# EAGLE design board (EAGLE 7.5.0)
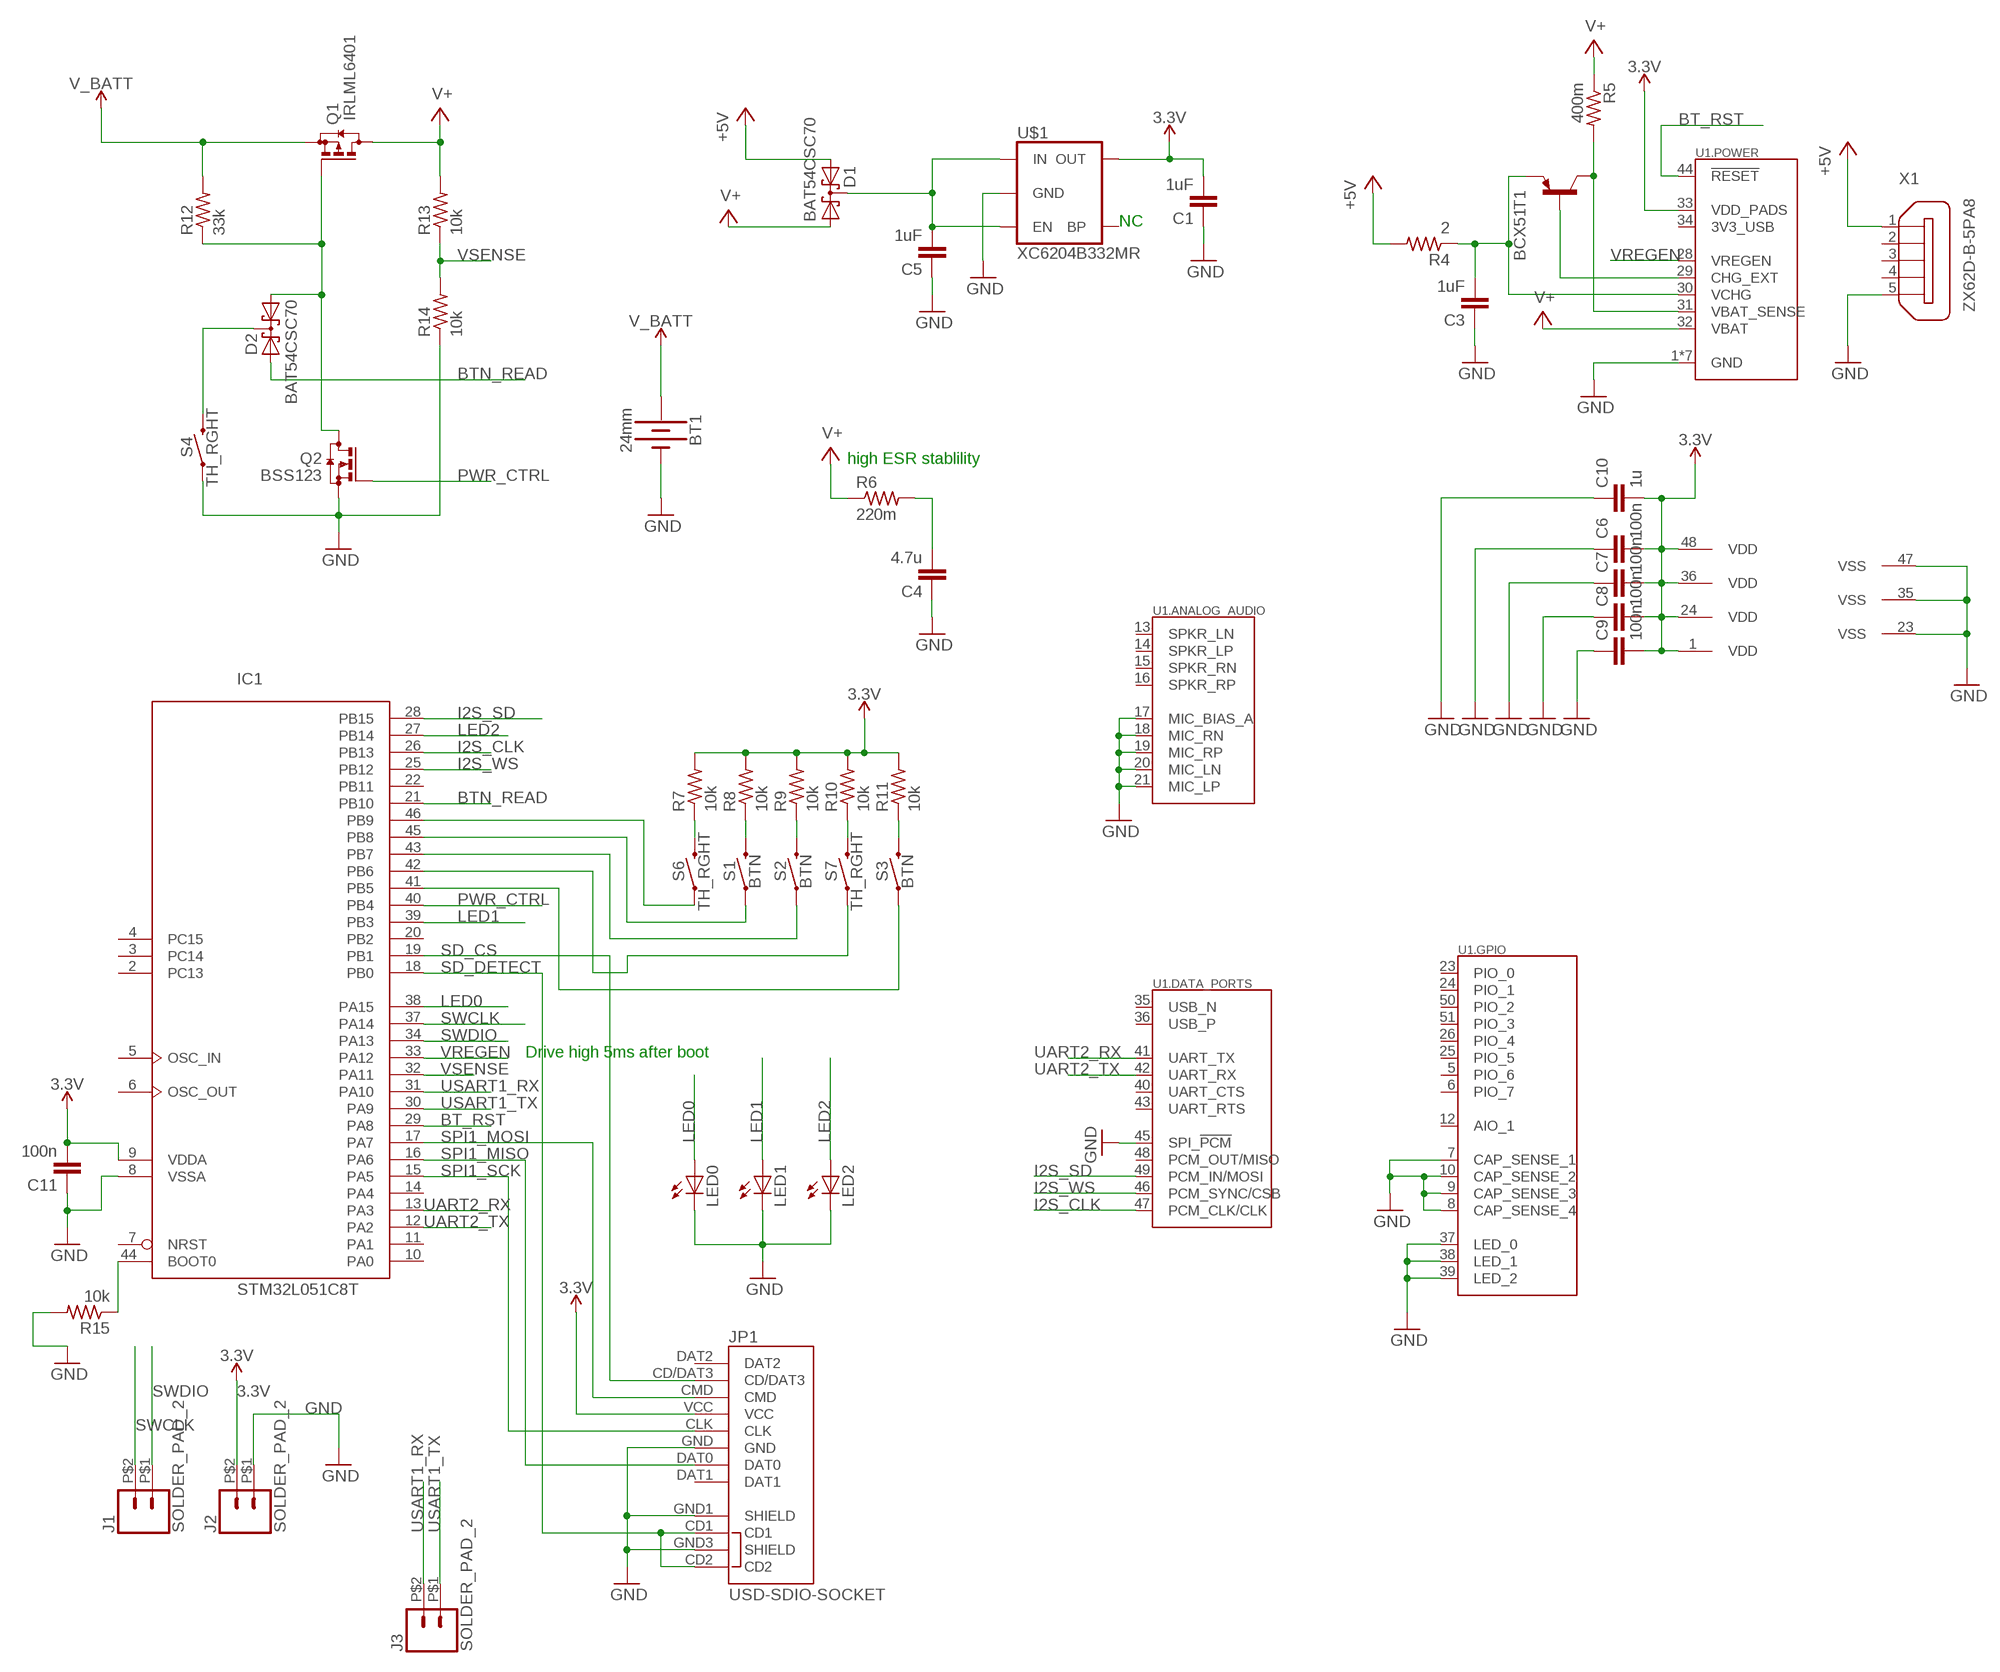
[diagram p0: schematic, sheet 1]

## Parts
BT1  24mm  BATTERY-24.5MM_PTH  [BATTCON_24.5MM_PTH]
C1  1uF  C-EUC1206  [C1206]
C3  1uF  C-EUC1206  [C1206]
C4  4.7u  C-EUC1206  [C1206]
C5  1uF  C-EUC1206  [C1206]
C6  100n  C-EUC0805  [C0805]
C7  100n  C-EUC0805  [C0805]
C8  100n  C-EUC0805  [C0805]
C9  100n  C-EUC0805  [C0805]
C10  1u  C-EUC0805  [C0805]
C11  100n  C-EUC0805  [C0805]
D1  BAT54CSC70  [SOT323-R]
D2  BAT54CSC70  [SOT323-R]
IC1  STM32L051C8T  [LQFP48]
J1  SOLDER_PAD_2  [SOLDER_PAD_2]
J2  SOLDER_PAD_2  [SOLDER_PAD_2]
J3  SOLDER_PAD_2  [SOLDER_PAD_2]
JP1  USD-SDIO-SOCKET  [MICRO-SD-SOCKET-SDIO]
LED0  LEDSML0805  [SML0805]
LED1  LEDSML0805  [SML0805]
LED2  LEDSML0805  [SML0805]
Q1  IRLML6401  BSS84  [SOT23]
Q2  BSS123  [SOT23]
R4  2  R-US_M1206  [M1206]
R5  400m  R-US_M1206  [M1206]
R6  220m  R-US_M1206  [M1206]
R7  10k  R-US_R0805  [R0805]
R8  10k  R-US_R0805  [R0805]
R9  10k  R-US_R0805  [R0805]
R10  10k  R-US_R0805  [R0805]
R11  10k  R-US_R0805  [R0805]
R12  33k  R-US_R0805  [R0805]
R13  10k  R-US_R0805  [R0805]
R14  10k  R-US_R0805  [R0805]
R15  10k  R-US_R0805  [R0805]
S1  BTN  MOMENTARY-SWITCH-SPST-SMD-6.2MM-TALL  [TACTILE_SWITCH_SMD_6.2MM_TALL]
S2  BTN  MOMENTARY-SWITCH-SPST-SMD-6.2MM-TALL  [TACTILE_SWITCH_SMD_6.2MM_TALL]
S3  BTN  MOMENTARY-SWITCH-SPST-SMD-6.2MM-TALL  [TACTILE_SWITCH_SMD_6.2MM_TALL]
S4  TH_RGHT  MOMENTARY-SWITCH-SPST-PTH-RIGHT-ANGLE  [TACTILE_SWITCH_PTH_RIGHT_ANGLE]
S6  TH_RGHT  MOMENTARY-SWITCH-SPST-PTH-RIGHT-ANGLE  [TACTILE_SWITCH_PTH_RIGHT_ANGLE]
S7  TH_RGHT  MOMENTARY-SWITCH-SPST-PTH-RIGHT-ANGLE  [TACTILE_SWITCH_PTH_RIGHT_ANGLE]
T1  BCX51  -PNP-SOT89-ECB  [SOT89-ECB]
U1  BC127"  [BC127]
U$1  XC6204B332MR  V_REG_SPX3819-SOT23-5  [SOT23-5]
X1  ZX62D-B-5PA8  [ZX62D-B-5PA8]

## Nets
3.3V: C1.2 C6.2 C7.2 C8.2 C9.2 C10.2 C11.2 IC1.1(VDD) IC1.9(VDDA) IC1.24(VDD) IC1.36(VDD) IC1.48(VDD) J2.P$2 JP1.VCC R7.2 R8.2 R9.2 R10.2 R11.2 U1.33(.POWER:VDD_PADS) U$1.5(OUT)
+5V [Power]: D1.2(A2) R4.2 X1.1
BOOT0: IC1.44(BOOT0) R15.1
BT_RST: IC1.29(PA8) U1.44(.POWER:!RESET)
BTN_READ: D2.2(A2) IC1.21(PB10)
GND: BT1.2(-) C1.1 C3.1 C4.1 C5.1 C6.1 C7.1 C8.1 C9.1 C10.1 C11.1 IC1.8(VSSA) IC1.23(VSS) IC1.35(VSS) IC1.47(VSS) J2.P$1 JP1.GND JP1.GND1(SHIELD) JP1.GND3(SHIELD) LED0.C LED1.C LED2.C Q2.2(S) R14.1 R15.2 S4.1 U1.1(.POWER:GND) U1.2(.POWER:GND) U1.3(.POWER:GND) U1.4(.POWER:GND) U1.7(.GPIO:CAP_SENSE_1) U1.8(.GPIO:CAP_SENSE_4) U1.9(.GPIO:CAP_SENSE_3) U1.10(.GPIO:CAP_SENSE_2) U1.11(.POWER:GND) U1.17(.ANALOG_AUDIO:MIC_BIAS_A) U1.18(.ANALOG_AUDIO:MIC_RN) U1.19(.ANALOG_AUDIO:MIC_RP) U1.20(.ANALOG_AUDIO:MIC_LN) U1.21(.ANALOG_AUDIO:MIC_LP) U1.22(.POWER:GND) U1.27(.POWER:GND) U1.37(.GPIO:LED_0) U1.38(.GPIO:LED_1) U1.39(.GPIO:LED_2) U1.45(.DATA_PORTS:SPI_!PCM) U$1.2(GND) X1.5
I2S_CLK: IC1.26(PB13) U1.47(.DATA_PORTS:PCM_CLK/CLK)
I2S_SD: IC1.28(PB15) U1.49(.DATA_PORTS:PCM_IN/MOSI)
I2S_WS: IC1.25(PB12) U1.46(.DATA_PORTS:PCM_SYNC/CSB)
LED0: IC1.38(PA15) LED0.A
LED1: IC1.39(PB3) LED1.A
LED2: IC1.27(PB14) LED2.A
N$4: D2.1(A1) Q1.1(G) Q2.3(D) R12.1
N$5 [Power]: C3.2 R4.1 T1.E U1.30(.POWER:VCHG)
N$6 [Power]: T1.B U1.29(.POWER:CHG_EXT)
N$7 [Power]: R5.2 T1.C U1.31(.POWER:VBAT_SENSE)
N$8: C4.2 R6.2
N$9 [Power]: C5.2 D1.3(CC) U$1.1(IN) U$1.3(EN)
N$12: R7.1 S6.2
N$13: R8.1 S1.B2
N$14: R9.1 S2.B2
N$15: R10.1 S7.2
N$16: R11.1 S3.B2
N$17: IC1.46(PB9) S6.1
N$18: IC1.45(PB8) S1.A2
N$19: IC1.43(PB7) S2.A2
N$20: IC1.42(PB6) S7.1
N$21: IC1.41(PB5) S3.A2
N$25: D2.3(CC) S4.2
PWR_CTRL: IC1.40(PB4) Q2.1(G)
SD_CS: IC1.19(PB1) JP1.CD/DAT3
SD_DETECT: IC1.18(PB0) JP1.CD1 JP1.CD2
SPI1_MISO: IC1.16(PA6) JP1.DAT0
SPI1_MOSI: IC1.17(PA7) JP1.CMD
SPI1_SCK: IC1.15(PA5) JP1.CLK
SWCLK: IC1.37(PA14) J1.P$2
SWDIO: IC1.34(PA13) J1.P$1
UART2_RX: IC1.13(PA3) U1.41(.DATA_PORTS:UART_TX)
UART2_TX: IC1.12(PA2) U1.42(.DATA_PORTS:UART_RX)
USART1_RX: IC1.31(PA10) J3.P$2
USART1_TX: IC1.30(PA9) J3.P$1
V+ [Power]: D1.1(A1) Q1.3(D) R5.1 R6.1 R13.2 U1.32(.POWER:VBAT)
V_BATT [Power]: BT1.3(+) Q1.2(S) R12.2
VREGEN: IC1.33(PA12) U1.28(.POWER:VREGEN)
VSENSE: IC1.32(PA11) R13.1 R14.2
Unconnected: IC1.2(PC13) IC1.3(PC14) IC1.4(PC15) IC1.5(OSC_IN) IC1.6(OSC_OUT) IC1.7(NRST) IC1.10(PA0) IC1.11(PA1) IC1.14(PA4) IC1.20(PB2) IC1.22(PB11) JP1.DAT1 JP1.DAT2 U1.5(.GPIO:PIO_6) U1.6(.GPIO:PIO_7) U1.12(.GPIO:AIO_1) U1.13(.ANALOG_AUDIO:SPKR_LN) U1.14(.ANALOG_AUDIO:SPKR_LP) U1.15(.ANALOG_AUDIO:SPKR_RN) U1.16(.ANALOG_AUDIO:SPKR_RP) U1.23(.GPIO:PIO_0) U1.24(.GPIO:PIO_1) U1.25(.GPIO:PIO_5) U1.26(.GPIO:PIO_4) U1.34(.POWER:3V3_USB) U1.35(.DATA_PORTS:USB_N) U1.36(.DATA_PORTS:USB_P) U1.40(.DATA_PORTS:UART_CTS) U1.43(.DATA_PORTS:UART_RTS) U1.48(.DATA_PORTS:PCM_OUT/MISO) U1.50(.GPIO:PIO_2) U1.51(.GPIO:PIO_3) U$1.4(BP) X1.2 X1.3 X1.4 X1.S1 X1.S2 X1.S3 X1.S4

## Notes on the sheet
- NC
- high ESR stablility
- Drive high 5ms after boot

## Library data of the parts
BT1 = SparkFun-Batteries:BATTERY: Battery - Single Cell A variety of battery chemistries, sizes, and footprints. Device List: 20MM_PTH - Coin Cell Battery Holder - 20mm (PTH) <https://www.sparkfun.com/products/783> 20MM_PTH_KIT- Coin Cell battery Holder - 20 mm (PTH) <http://www.sparkfun.com/products/783>kit version with special mask 6.8MM_PTH - Coin Cell Battery Holder - 6.8MM(SMD) <https://www.digikey.com/product-detail/en/seiko-instruments/MS621FE-FL11E/728-1057-ND/1889208?WT.srch=1&gclid=CNOQ5a6LzdQCFZS2wAodXCkE0g> 12MM_SMD - Coin Cell Battery Holder - 12mm (SMD) <https://www.sparkfun.com/products/10592> 12MM_PTH - Coin Cell Battery Holder - 12mm (PTH) <https://www.sparkfun.com/products/7948> 20MM_SMD - 20mm Coin Cell Battery Holder (SMD) (2 legs) Used on the Big Time Watch Kit <https://www.sparkfun.com/products/11734> 20MM_SMD_4LEGS - Coin Cell Battery Holder - 20mm (SMD) <https://www.sparkfun.com/products/11892> 20MM_SMD_4LEGS_OVERPASTE - Coin Cell Battery Holder - 20mm (SMD) <https://www.sparkfun.com/products/11892> (Over-paste on the legs) 24.5MM_PTH - Coin Cell Battery Holder - 24.5mm (PTH) <https://www.sparkfun.com/products/8863> 9V - 9V Battery Holder - PC Mount Used on the SparkFun SparkPunk Sound Kit <https://www.sparkfun.com/products/11177> and SparkFun SparkPunk Sequencer Kit <https://www.sparkfun.com/products/12707> 18650 - Battery Holder - 18650 (PTH) <https://www.sparkfun.com/products/13113> AA - Battery Holder - 1xAA (PTH) <https://www.sparkfun.com/products/7949> AAA - Battery Holder - 1xAAA (PTH) <https://www.sparkfun.com/products/12718> AA_KIT - Battery Holder - 1xAA (PTH) <https://www.sparkfun.com/products/7949> Special kit package - pads only have exposed copper on one side of the board. AAA_KIT - Battery Holder - 1xAAA (PTH) <https://www.sparkfun.com/products/12718> Special kit package - pads only have exposed copper on one side of the board.; SF_SKU: PRT-08863
C1 C3-C11 = rcl:C-EU: CAPACITOR, European symbol
D1 D2 = diode:BAT54C: Schottky Diodes Source: Fairchild .. BAT54.pdf
IC1 = micro-stm_v3:STM32L051C*T: ARM 32-bit Cortex™-M0+ CPU 32 MHz maximum frequency 32 to 64 Kbytes of Flash memory 2 kbyte of Data EEPROM 8 kbytes of SRAM 37 GPIOs 1.8 to 3.6 V application supply
J1-J3 = SparkFun-Connectors:SOLDER_PAD_2: Solder Pad for LuMini Rings
JP1 = SparkFun-Retired:USD-SDIO-SOCKET: microSD Socket Push-push type uSD socket with full SDIO signal mapping. Spark Fun Electronics SKU : PRT-00127. tDoc lines correctly indicate media card edge positions when inserting (unlocked, locked, depressed). NOTE: CD1 and CD2 are connected internally, and short to ground when card is removed.; PROD_ID: CONN-07820
LED0 LED1 LED2 = led:LED: LED OSRAM: - CHIPLED LG R971, LG N971, LY N971, LG Q971, LY Q971, LO R971, LY R971 LH N974, LH R974 LS Q976, LO Q976, LY Q976 LO Q996 - Hyper CHIPLED LW Q18S LB Q993, LB Q99A, LB R99A - SideLED LS A670, LO A670, LY A670, LG A670, LP A670 LB A673, LV A673, LT A673, LW A673 LH A674 LY A675 LS A676, LA A676, LO A676, LY A676, LW A676 LS A679, LY A679, LG A679 - Hyper Micro SIDELED® LS Y876, LA Y876, LO Y876, LY Y876 LT Y87S - SmartLED LW L88C, LW L88S LB L89C, LB L89S, LG L890 LS L89K, LO L89K, LY L89K LS L896, LA L896, LO L896, LY L896 - TOPLED LS T670, LO T670, LY T670, LG T670, LP T670 LSG T670, LSP T670, LSY T670, LOP T670, LYG T670 LG T671, LOG T671, LSG T671 LB T673, LV T673, LT T673, LW T673 LH T674 LS T676, LA T676, LO T676, LY T676, LB T676, LH T676, LSB T676, LW T676 LB T67C, LV T67C, LT T67C, LS T67K, LO T67K, LY T67K, LW E67C LS E67B, LA E67B, LO E67B, LY E67B, LB E67C, LV E67C, LT E67C LW T67C LS T679, LY T679, LG T679 LS T770, LO T770, LY T770, LG T770, LP T770 LB T773, LV T773, LT T773, LW T773 LH T774 LS E675, LA E675, LY E675, LS T675 LS T776, LA T776, LO T776, LY T776, LB T776 LHGB T686 LT T68C, LB T68C - Hyper Mini TOPLED® LB M676 - Mini TOPLED Santana® LG M470 LS M47K, LO M47K, LY M47K Source: http://www.osram.convergy.de LUXEON: - LUMILED® LXK2-PW12-R00, LXK2-PW12-S00, LXK2-PW14-U00, LXK2-PW14-V00 LXK2-PM12-R00, LXK2-PM12-S00, LXK2-PM14-U00 LXK2-PE12-Q00, LXK2-PE12-R00, LXK2-PE12-S00, LXK2-PE14-T00, LXK2-PE14-U00 LXK2-PB12-K00, LXK2-PB12-L00, LXK2-PB12-M00, LXK2-PB14-N00, LXK2-PB14-P00, LXK2-PB14-Q00 LXK2-PR12-L00, LXK2-PR12-M00, LXK2-PR14-Q00, LXK2-PR14-R00 LXK2-PD12-Q00, LXK2-PD12-R00, LXK2-PD12-S00 LXK2-PH12-R00, LXK2-PH12-S00 LXK2-PL12-P00, LXK2-PL12-Q00, LXK2-PL12-R00 Source: www.luxeon.com KINGBRIGHT: KA-3528ASYC Source: www.kingbright.com
Q1 = transistor-small-signal:BSS84: P-CHANNEL MOS FET
Q2 = transistor-small-signal:BSS123: N-CHANNEL MOS FET
R4-R6 = diversity-monitor:R-US_: RESISTOR, American symbol
R7-R15 = resistor:R-US_: RESISTOR, American symbol
S1-S3 = SparkFun-Switches:MOMENTARY-SWITCH-SPST: Momentary Switch (Pushbutton) - SPST Normally-open (NO) SPST momentary switches (buttons, pushbuttons). Variants PTH-12MM - 12mm square, through-hole Momentary Pushbutton Switch - 12mm Square <https://www.sparkfun.com/products/9190> (COM-09190) PTH-6.0MM, PTH-6.0MM-KIT - 6.0mm square, through-hole Mini Pushbutton Switch <https://www.sparkfun.com/products/97> (COM-00097) KIT package intended for soldering kit's - only one side of pads' copper is exposed. PTH-RIGHT-ANGLE-KIT - Right-angle, through-hole Right Angle Tactile Button <https://www.sparkfun.com/products/10791> - Used on SparkFun BigTime Watch Kit <https://www.sparkfun.com/products/11734> SMD-12MM - 12mm square, surface-mount Tactile Button - SMD (12mm) <https://www.sparkfun.com/products/12993> (COM-12993) Used on SparkFun PicoBoard <https://www.sparkfun.com/products/11888> SMD-4.5MM - 4.5mm Square Trackball Switch Used on SparkFun Blackberry Trackballer Breakout <https://www.sparkfun.com/products/13169> SMD-4.6MMX2.8MM - 4.60mm x 2.80mm, surface mount Used on SparkFun SAMD21 Mini Breakout <https://www.sparkfun.com/products/13664> SMD-5.2MM, SMD-5.2-REDUNDANT - 5.2mm square, surface-mount Mini Pushbutton Switch - SMD <https://www.sparkfun.com/products/8720> (COM-08720) Used on Arduino Pro Mini <https://www.sparkfun.com/products/11114> REDUNDANT package connects both switch circuits together SMD-6.0X3.5MM - 6.0 x 3.5mm, surface mount Momentary Reset Switch SMD <https://www.sparkfun.com/products/8229> (COM-08229) SMD-6.2MM-TALL - 6.2mm square, surface mount Tactile Button - SMD (6mm) <https://www.sparkfun.com/products/12992> Used on SparkFun Digital Sandbox <https://www.sparkfun.com/products/12651> SMD-RIGHT-ANGLE - Right-angle, surface mount Used on SparkFun Block for Intel® Edison - Arduino <https://www.sparkfun.com/products/13036>; PROD_ID: SWCH-11966; SF_SKU: COM-12992
S4 S6 S7 = SparkFun-Switches:MOMENTARY-SWITCH-SPST: Momentary Switch (Pushbutton) - SPST Normally-open (NO) SPST momentary switches (buttons, pushbuttons). Variants PTH-12MM - 12mm square, through-hole Momentary Pushbutton Switch - 12mm Square <https://www.sparkfun.com/products/9190> (COM-09190) PTH-6.0MM, PTH-6.0MM-KIT - 6.0mm square, through-hole Mini Pushbutton Switch <https://www.sparkfun.com/products/97> (COM-00097) KIT package intended for soldering kit's - only one side of pads' copper is exposed. PTH-RIGHT-ANGLE-KIT - Right-angle, through-hole Right Angle Tactile Button <https://www.sparkfun.com/products/10791> - Used on SparkFun BigTime Watch Kit <https://www.sparkfun.com/products/11734> SMD-12MM - 12mm square, surface-mount Tactile Button - SMD (12mm) <https://www.sparkfun.com/products/12993> (COM-12993) Used on SparkFun PicoBoard <https://www.sparkfun.com/products/11888> SMD-4.5MM - 4.5mm Square Trackball Switch Used on SparkFun Blackberry Trackballer Breakout <https://www.sparkfun.com/products/13169> SMD-4.6MMX2.8MM - 4.60mm x 2.80mm, surface mount Used on SparkFun SAMD21 Mini Breakout <https://www.sparkfun.com/products/13664> SMD-5.2MM, SMD-5.2-REDUNDANT - 5.2mm square, surface-mount Mini Pushbutton Switch - SMD <https://www.sparkfun.com/products/8720> (COM-08720) Used on Arduino Pro Mini <https://www.sparkfun.com/products/11114> REDUNDANT package connects both switch circuits together SMD-6.0X3.5MM - 6.0 x 3.5mm, surface mount Momentary Reset Switch SMD <https://www.sparkfun.com/products/8229> (COM-08229) SMD-6.2MM-TALL - 6.2mm square, surface mount Tactile Button - SMD (6mm) <https://www.sparkfun.com/products/12992> Used on SparkFun Digital Sandbox <https://www.sparkfun.com/products/12651> SMD-RIGHT-ANGLE - Right-angle, surface mount Used on SparkFun Block for Intel® Edison - Arduino <https://www.sparkfun.com/products/13036>; PROD_ID: CONN-10672; SF_SKU: COM-10791
T1 = transistor:*-PNP-: PNP Transistror
U1 = SparkFun-RF:BC127: Blue Creations BC127 BLE module The BC127 is a highly flexible, low power, small form factor Bluetooth Version 4.0 Certified Audio module. It comes preloaded with BlueCreation Melody software, and is ideal for developers who want to quickly and cost effectively integrate Bluetooth functionality into their products. SparkFun Products: Bluetooth SMD Module - BC127 <https://www.sparkfun.com/products/12819> (WRL-12819) Bluetooth Audio Breakout - BC127 <https://www.sparkfun.com/products/11927> (WRL-11927) Purpletooth Jamboree - BC127 Development Board <https://www.sparkfun.com/products/11924> (WRL-11924); PROD_ID: IC-11659
U$1 = SparkFun-IC-Power:V_REG_SPX3819: SPX3819 Voltage Regulator 3.3V 500mA, 16V input Datasheet <https://www.exar.com/content/document.ashx?id=22106> SparkFun Products: SparkFun Serial Controlled Motor Driver <https://www.sparkfun.com/products/13911>; PROD_ID: VREG-13321; VALUE: SPX3819M5_3_3
X1 = zx62d-b-5pa8-oshpark_10:ZX62D-B-5PA8: Micro USB Type B Connector - Standard, Shell Through Hole Source: http://www.hirose.co.jp/cataloge_hp/ed_ZX_20140804.pdf; MF: Hirose; MPN: ZX62D-B-5PA8; OC_FARNELL: 2300438; OC_NEWARK: 69W0712

## Net classes
1 Power: width 0.254 mm

## Board
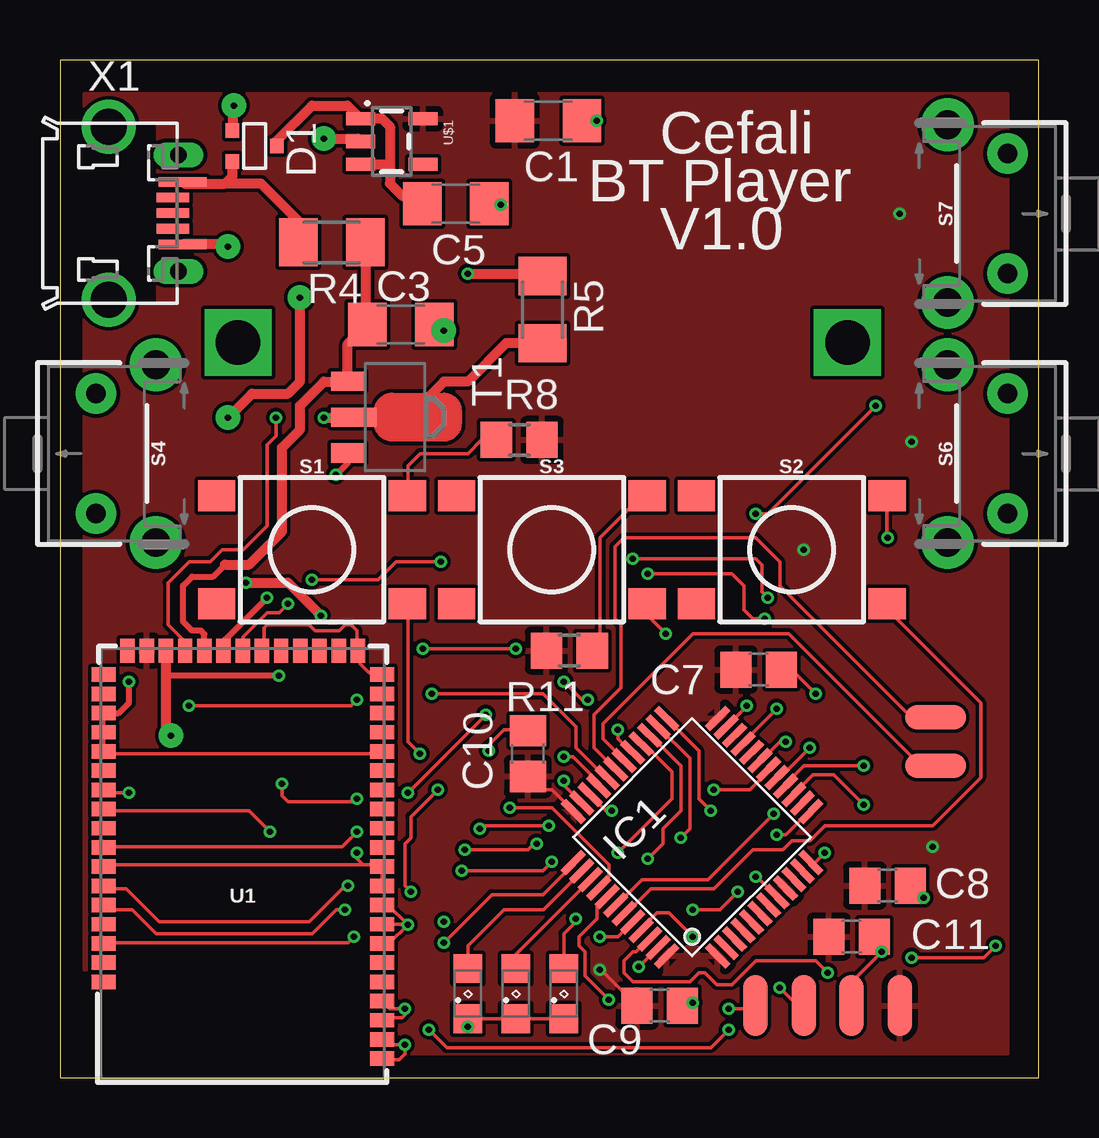
[diagram p1: board, top side]
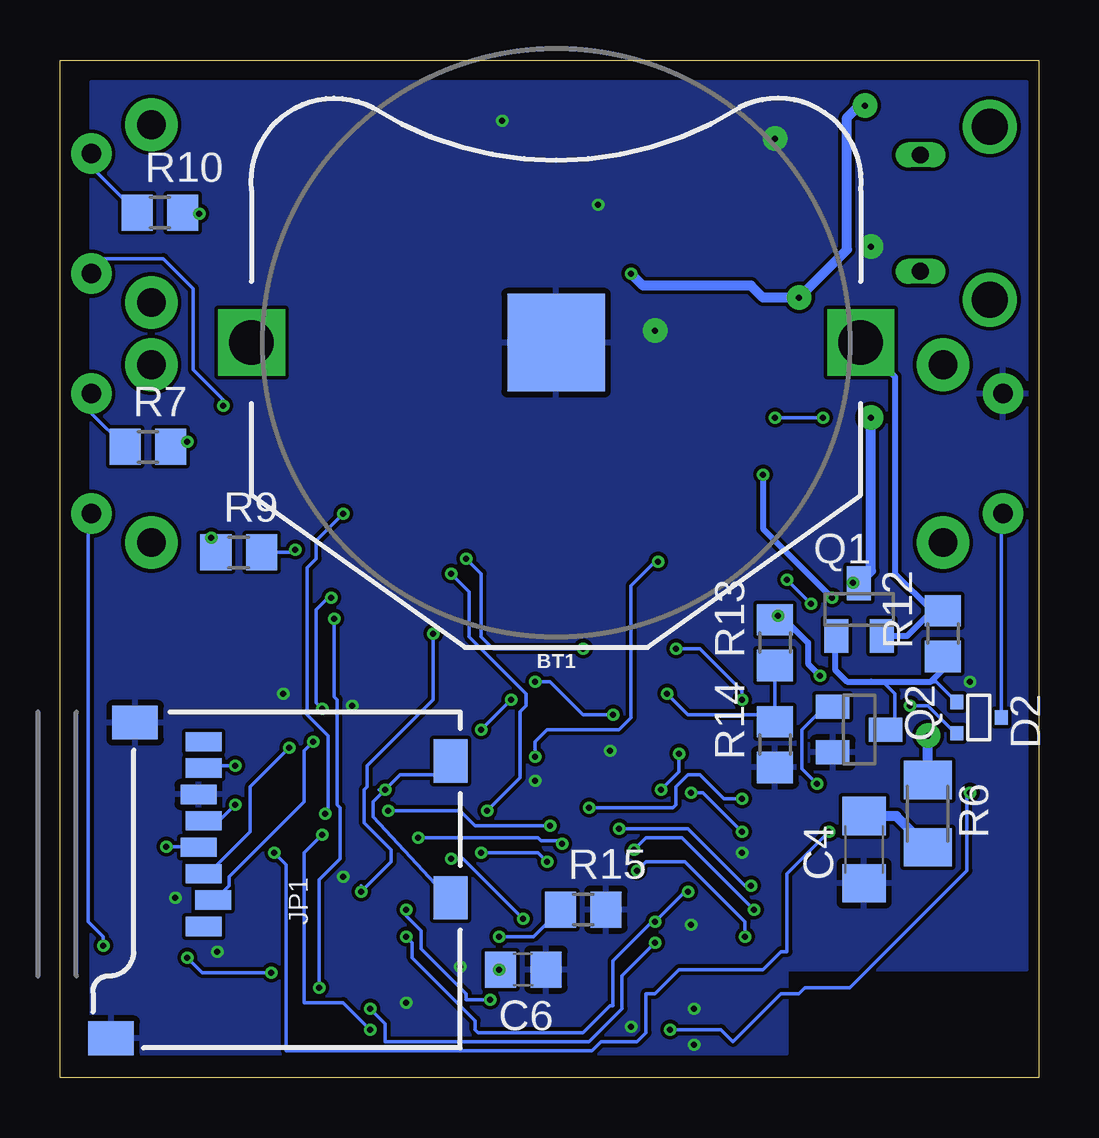
[diagram p2: board, bottom side, seen from below]

Size 40.81 x 42.4 mm. Coordinates in mm from the lower left corner, seen from the top.
Outline: 0,0 40.81,0 40.81,42.4 0,42.4 0,0
Copper layers (1*16): Top 0.035559375mm / dielectric 1.6mm / Bottom 0.035559375mm
Design rules "oshpark-2layer": minimum track width 6mil, minimum drill 10mil, track to track 6mil, track to pad 6mil, pad to pad 6mil, via to via 6mil, smd to smd 6mil, copper to edge 15mil, drill to drill 6mil, minimum pad ring 5mil, minimum via ring 5mil, stop-mask expansion 2.5mil, vias tented up to drill 0mil, thermal gap 10mil

### Footprints (pad centres in the part's own frame; a part is rotated, then mirrored left to right if it is on the bottom)
BATTCON_24.5MM_PTH = drill 1.854 square: 1 -12.7,0; 3 12.7,0 | smd 4.064 x 4.064: 2 0,0
C1206 = smd 1.6 x 1.8: 1 -1.4,0; 2 1.4,0
C0805 = smd 1.3 x 1.5: 1 -0.95,0; 2 0.95,0
SOT323-R = smd 0.6 x 0.55: 1 -0.65,-0.925; 2 0.65,-0.925; 3 0,0.925
LQFP48 = smd 0.3 x 1.2: 1 -2.75,-4.25; 2 -2.25,-4.25; 3 -1.75,-4.25; 4 -1.25,-4.25; 5 -0.75,-4.25; 6 -0.25,-4.25; 7 0.25,-4.25; 8 0.75,-4.25; 9 1.25,-4.25; 10 1.75,-4.25; 11 2.25,-4.25; 12 2.75,-4.25; 25 2.75,4.25; 26 2.25,4.25; 27 1.75,4.25; 28 1.25,4.25; 29 0.75,4.25; 30 0.25,4.25; 31 -0.25,4.25; 32 -0.75,4.25; 33 -1.25,4.25; 34 -1.75,4.25; 35 -2.25,4.25; 36 -2.75,4.25 | smd 1.2 x 0.3: 13 4.25,-2.75; 14 4.25,-2.25; 15 4.25,-1.75; 16 4.25,-1.25; 17 4.25,-0.75; 18 4.25,-0.25; 19 4.25,0.25; 20 4.25,0.75; 21 4.25,1.25; 22 4.25,1.75; 23 4.25,2.25; 24 4.25,2.75; 37 -4.25,2.75; 38 -4.25,2.25; 39 -4.25,1.75; 40 -4.25,1.25; 41 -4.25,0.75; 42 -4.25,0.25; 43 -4.25,-0.25; 44 -4.25,-0.75; 45 -4.25,-1.25; 46 -4.25,-1.75; 47 -4.25,-2.25; 48 -4.25,-2.75
SOLDER_PAD_2 = smd 1.016 x 2.54: P$1 -1.016,0; P$2 1.016,0
MICRO-SD-SOCKET-SDIO = smd 1.8 x 1.4: CD1 11.92,0.4; CD2 6.22,0.4 | smd 0.8 x 1.5: CD/DAT3 6.13,10.3; CLK 9.43,10.7; CMD 7.23,10.7; DAT0 11.63,10.7; DAT1 12.73,10.7; DAT2 5.03,10.7; GND 10.53,10.9; VCC 8.33,10.9 | smd 1.4 x 1.9: GND1 0.37,14.55; GND3 13.52,13.55
SML0805 = smd 1.2 x 1.2: A 1.05,0; C -1.05,0
SOT23 = smd 1 x 1.4: 1 -0.95,-1.1; 2 0.95,-1.1; 3 0,1.1
M1206 = smd 1.6 x 2: 1 -1.4,0; 2 1.4,0
R0805 = smd 1.3 x 1.5: 1 -0.95,0; 2 0.95,0
TACTILE_SWITCH_SMD_6.2MM_TALL = smd 1.55 x 1.3: A1 -3.975,-2.25; A2 3.975,-2.25; B1 -3.975,2.25; B2 3.975,2.25
TACTILE_SWITCH_PTH_RIGHT_ANGLE = drill 0.8 pad 1.7: 1 -2.5,0; 2 2.5,0 | drill 1.2 pad 2.2: ANCHOR1 -3.703,2.5; ANCHOR2 3.703,2.5
SOT89-ECB = smd 0.8 x 1.4: B 1.499,-1.981; E -1.499,-1.981 | smd 0.8 x 1.9: C 0,-1.727
BC127 = smd 1 x 0.6: 1 -5.8,8.1; 2 -5.8,7.3; 3 -5.8,6.5; 4 -5.8,5.7; 5 -5.8,4.9; 6 -5.8,4.1; 7 -5.8,3.3; 8 -5.8,2.5; 9 -5.8,1.7; 10 -5.8,0.9; 11 -5.8,0.1; 12 -5.8,-0.7; 13 -5.8,-1.5; 14 -5.8,-2.3; 15 -5.8,-3.1; 16 -5.8,-3.9; 17 -5.8,-4.7; 18 -5.8,-5.5; 19 -5.8,-6.3; 20 -5.8,-7.1; 21 -5.8,-7.9; 35 5.8,-7.9; 36 5.8,-7.1; 37 5.8,-6.3; 38 5.8,-5.5; 39 5.8,-4.7; 40 5.8,-3.9; 41 5.8,-3.1; 42 5.8,-2.3; 43 5.8,-1.5; 44 5.8,-0.7; 45 5.8,0.1; 46 5.8,0.9; 47 5.8,1.7; 48 5.8,2.5; 49 5.8,3.3; 50 5.8,4.1; 51 5.8,4.9 | smd 0.6 x 1: 22 -4.8,-8.9; 23 -4,-8.9; 24 -3.2,-8.9; 25 -2.4,-8.9; 26 -1.6,-8.9; 27 -0.8,-8.9; 28 0,-8.9; 29 0.8,-8.9; 30 1.6,-8.9; 31 2.4,-8.9; 32 3.2,-8.9; 33 4,-8.9; 34 4.8,-8.9
SOT23-5 = smd 0.55 x 1.2: 1 -0.95,-1.3; 2 0,-1.3; 3 0.95,-1.3; 4 0.95,1.3; 5 -0.95,1.3
ZX62D-B-5PA8 = smd 2 x 0.4: 1 5.225,1.3; 5 5.225,-1.3 | smd 1.35 x 0.4: 2 4.825,0.65; 3 4.825,0; 4 4.825,-0.65 | drill 1.5: S1 2.15,-3.6; S2 2.15,3.6 | drill 0.7 long: S3 5.05,2.425; S4 5.05,-2.425

### Placement (x,y rotation side)
BT1  20.12,30.62 0 bottom
C1  20.36,39.87 180 top
C3  14.21,31.38 180 top
C4  7.29,9.5 90 bottom
C5  16.5,36.41 180 top
C6  21.5,4.5 180 bottom
C7  29.12,17 180 top
C8  34.5,8 180 top
C9  25,3 180 top
C10  19.5,13.5 270 top
C11  33,5.88 180 top
D1  8.12,38.81 270 top
D2  2.5,15 270 bottom
IC1  26.35,10.02 45 top
J1  30,3 180 top
J2  34,3 0 top
J3  36.5,14 90 top
JP1  24.13,1.27 90 bottom
LED0  17,3.5 90 top
LED1  19,3.5 90 top
LED2  21,3.5 90 top
Q1  7.5,19.5 0 bottom
Q2  7.5,14.5 270 bottom
R4  11.33,34.8 180 top
R5  20.11,32 270 top
R6  4.64,11 270 bottom
R7  37.14,26.28 0 bottom
R8  19.14,26.57 0 top
R9  33.36,21.88 0 bottom
R10  36.64,36.04 0 bottom
R11  21.23,17.79 180 top
R12  4,18.5 90 bottom
R13  11,18.12 90 bottom
R14  11,13.88 90 bottom
R15  19,7 0 bottom
S1  10.5,22 0 top
S2  30.5,22 0 top
S3  20.5,22 0 top
S4  1.5,26 270 top
S6  39.5,26 90 top
S7  39.5,36 90 top
T1  13.98,27.52 270 top
U1  7.62,8.89 180 top
U$1  13.83,39.01 270 top
X1  -0.11,36.02 0 top

### Tracks (layer width: path | path; a pad name or v marks a point on that pad's centre or on a via)
3.3V  (via drill 0.25 pad 0.25)
  Top 0.152: v22.5,4.5 22.55,4.5 C9.2 | IC1.36 21.4,11.1 20.5,12 20,12 19.5,12.5 C10.2
  Bottom 0.152: v22.5,4.5 C6.2 | JP1.VCC 35.05,9.62 v36.38,9.62 | R7.2 35.97,26.5 v35.5,26.5 | R10.2 35.65,36 v35,36 | R9.2 31.12,21.88 v31,22
  pour Top: 1,41 39.5,41 39.5,1 10.5,1 10.5,4.5 1,4.5
+5V
  Top 0.406: X1.1 5.18,37.25 6.88,37.25 | 6.88,37.25 7.19,37.56 D1.2 | R4.2 9.93,35.7 8.38,37.25 6.88,37.25
BOOT0  (via drill 0.25 pad 0.25)
  Top 0.152: IC1.44 23.86,6.49 23.25,5.88 v22.5,5.88
  Bottom 0.152: v22.5,5.88 21.07,5.88 R15.1
BT_RST  (via drill 0.25)
  Top 0.152: v12.38,10.25 11.75,9.62 1.88,9.62 U1.44 | v17.75,15.12 v14.5,11.88 | v21,16.5 21.75,15.75 v22,15.75 | v23.25,14.5 23.25,14.12 23.88,13.5 IC1.29
  Bottom 0.152: v12.38,10.25 14,11.88 v14.5,11.88 | v17.75,15.12 19,15.12 20.38,16.5 v21,16.5 | v23.25,14.5 v22,15.75
BTN_READ  (via drill 0.25, 0.25 pad 0.25)
  Top 0.152: v5.38,15.5 12.12,15.5 v12.38,15.75 | v29.88,15.38 28.5,14 IC1.21 | v15.12,17.88 v19,17.88 | v23.88,21.62 29,21.62 29.25,21.38 29.25,20.25 v29.5,20
  Bottom 0.152: v5.38,15.5 4.62,15.5 3.5,14.38 D2.2 | v29.88,15.38 30.12,15.62 30.12,19.5 29.62,20 v29.5,20 | v12.38,15.75 12.38,16.12 14.12,17.88 v15.12,17.88 | v23.88,21.62 23.56,21.31 23.5,21.25 23.25,21 23.25,18.38 22.75,17.88 v19,17.88
GND  (via drill 0.25, 0.25 pad 0.25, 0.25 pad 1.02)
  Top 0.152: U1.37 U1.38 U1.39 1.88,13.5 13.38,13.5 U1.17 13.5,13.62 13.5,14.38 U1.18 13.5,14.5 13.5,15.12 U1.19 13.5,15.25 13.5,15.88 U1.20 13.5,16 13.5,16.75 U1.21 13.38,16.88 12.88,16.88 12.5,17.25 12.5,17.75 U1.22 12.38,17.88 12.38,18.62 12.12,18.88 11.88,18.88 11.62,18.62 10.62,18.62 10.38,18.88 8.62,18.88 8.5,18.75 8.5,17.88 U1.27 | C9.1 26.07,3.12 v26.38,3.12 | IC1.47 24.14,4.62 v24.12,4.62 | IC1.35 21,12.19 v21,12.38 | 19.38,14.57 C10.1 19.45,14.5 18.5,14.5 17.88,13.88 v17.88,13.62 | IC1.23 28.62,15.48 v28.62,15.5 | v34.25,5.25 34.25,5.58 C11.1 v34.25,5.25 | C8.1 35.95,7.5 v36,7.5 | IC1.8 29.06,8.38 v29,8.38 | U1.1 13.46,0.75 14.12,0.75 14.38,1 v14.38,1.38 13.63,1.38 U1.2 | U1.4 13.73,2.88 v14.38,2.88 14.38,2.62 14.25,2.5 13.53,2.5 U1.3 | 13.44,6.38 U1.8 14.48,6.39 v14.5,6.38 | 12.62,8.88 13.34,8.88 U1.11 U1.10 | 12.62,8.88 12.38,9.12 v12.38,9.38 | v7,34.62 6.91,34.72 | v17,2.12 LED0.C LED1.C | 19,2.12 LED1.C | 21,2.12 LED2.C LED1.C | C1.1 v22.37,39.87 v22.38,39.88 | 12.62,8.88 1.88,8.88 U1.45 | v34.25,5.25 33,4 33,3 J2.P$1 | 19.3,2.75 LED1.C | C7.1 30.5,17 v31.5,16 | U1.9 13.69,7.19 v14.5,6.38 | U1.7 13.71,5.59 v14.5,6.38
  Top 0.254: U1.37 2.44,15.19 2.88,15.62 v2.88,16.5
  Top 0.406: 6.91,34.72 X1.5 | U$1.2 12.41,39.12 v11,39.12 | C3.1 15.74,31.38 v16,31.12 | C5.1 18.34,36.41 v18.38,36.38
  pour Bottom: 0.5,41.5 39.5,41.5 39.5,1 10.5,1 10.5,4.5 0.5,4.5
I2S_CLK  (via drill 0.25, 0.25 pad 0.25)
  Top 0.152: U1.47 2.01,7 3,7 4,6 10.5,6 11.5,7 v11.88,7 | v19.88,9.75 19.75,9.75 19.5,9.5 v16.88,9.5 | 25.01,14.62 IC1.26 26.25,13.3 26.25,10.38 v25.88,10
  Bottom 0.152: v19.88,9.75 20,9.88 20.75,9.88 20.88,10 v25.88,10 | v11.88,7 14.88,10 16.38,10 v16.88,9.5
I2S_SD  (via drill 0.25, 0.25 pad 0.25)
  Top 0.152: U1.49 1.85,5.62 12,5.62 v12.25,5.88 | v23.25,9.38 25.5,11.62 25.5,12.75 24.34,13.91 IC1.28 | v16.75,8.62 20.12,8.62 v20.5,9
  Bottom 0.152: v20.5,9 20.88,9.38 v23.25,9.38 | v12.25,5.88 12.25,6.5 14.75,9 16.38,9 v16.75,8.62
I2S_WS  (via drill 0.25 pad 0.25)
  Top 0.152: U1.46 1.94,7.88 2.75,7.88 4.12,6.5 10.38,6.5 11.88,8 v12,8 | IC1.25 25.4,14.85 26.62,13.62 26.62,11.62 v27.12,11.12 | v20.38,10.5 17.62,10.5 v17.5,10.38
  Bottom 0.152: v20.38,10.5 23.5,10.5 24.12,11.12 v27.12,11.12 | v12,8 12.25,8 14.62,10.38 v17.5,10.38
LED0
  Top 0.152: LED0.A 17,5.5 18.5,7 20.15,7 IC1.38
LED1
  Top 0.152: LED1.A 19,5.14 IC1.39
LED2  (via drill 0.25 pad 0.25)
  Top 0.152: IC1.27 24.61,14.26 25.88,13 25.88,11.12 25.12,10.38 25.12,9.75 v24.5,9.12 | v21.5,6.62 21.5,6.5 21,6 LED2.A
  Bottom 0.152: v24.5,9.12 24,9.12 v21.5,6.62
N$4
  Bottom 0.152: D2.1 4.28,16.5 4.5,16.5 | Q2.3 6,14.9 6,16 6.5,16.5 7,16.5
  Bottom 0.254: Q1.1 8.5,18.35 8.5,17 8,16.5 7,16.5 4.5,16.5 4,17 R12.1
N$5
  Top 0.254: U1.30 6.02,18.48 5.88,18.62 5.5,18.62 5.12,19 5.12,20.5 5.5,20.88 6.38,20.88 6.88,21.38
  Top 0.406: 6.88,21.38 7.88,21.38 9.25,22.75 9.25,26.25 10,27 10,28 11,29 11.98,29 T1.E 12,30.57 C3.2 12.93,31.5 13,31.5 12.73,31.77 R4.1
N$6  (via drill 0.25)
  Top 0.254: v8.62,20 6.88,18.25 6.88,17.88 U1.29 | v11.5,25.12 12,25.62 12,26 T1.B
  Bottom 0.254: v8.62,20 11.5,22.88 v11.5,25.12
N$7  (via drill 0.25 pad 0.25)
  Top 0.152: v9,27.5 9,26.75 8.62,26.38 8.62,23 7.62,22 6.75,22 6.25,21.5 5.38,21.5 4.5,20.62 4.5,18.88 5.12,18.25 5.12,17.89 U1.31
  Top 0.406: R5.2 18.6,30.6 17,29 16,29 14.5,27.5 12.27,27.5 T1.C 12.23,27.5 v11,27.5
  Bottom 0.152: v11,27.5 v9,27.5
N$8
  Bottom 0.406: R6.2 5.94,10.9 C4.2
N$9
  Top 0.406: D1.3 9.04,39.04 10.5,40.5 11.98,40.5 U$1.1 13.42,39.95 13.75,39.62 13.75,38 | 13.75,38 13.75,37.25 14.25,36.75 14.76,36.75 C5.2 | U$1.3 13.7,38.05 13.75,38
N$12
  Bottom 0.152: R7.1 39.5,27.69 S6.2
N$13
  Top 0.152: R8.1 17.57,26.57 17,26 15,26 14.5,25.5 14.5,24.27 S1.B2
N$14  (via drill 0.25 pad 0.25)
  Top 0.152: v34.5,22.5 34.48,22.52 S2.B2
  Bottom 0.152: R9.1 34.5,22.07 v34.5,22.5
N$15
  Bottom 0.152: R10.1 39.5,37.95 S7.2
N$16
  Top 0.152: S3.B2 24.25,24.25 22.5,22.5 22.5,18.11 R11.1
N$17  (via drill 0.25, 0.25 pad 0.25)
  Top 0.152: v32,4.38 31.5,4.88 29,4.88 28,3.88 27.38,3.88 26.88,4.38 26.62,4.38 26.25,4 23.88,4 23.5,4.38 23.5,4.88 23.88,5.25 24,5.25 24.5,5.75 IC1.46 | v35.5,5 38.5,5 v39,5.5
  Bottom 0.152: S6.1 39.62,23.38 39.62,6.5 39,5.88 v39,5.5 | v32,4.38 34.88,4.38 v35.5,5
N$18  (via drill 0.25, 0.25 pad 0.25)
  Top 0.152: v26.38,5.88 25.38,6.88 24.88,6.88 24.25,6.25 IC1.45 | v15.75,12 14.62,10.88 14.62,10 14.38,9.75 14.38,8 v14.62,7.75 | S1.A2 14.5,19.73 14.5,14 v15,13.5
  Bottom 0.152: v26.38,5.88 26.12,5.62 26.12,5 23.5,2.38 23.5,2 23.38,1.88 19,1.88 17.88,3 17.75,3 17.75,4.88 16.12,6.5 v16,6.5 14.75,7.75 v14.62,7.75 | v15,13.5 15,12.75 v15.75,12
N$19
  Top 0.152: IC1.43 23.62,6.88 24.62,7.88 27.25,7.88 28.88,9.5 30.12,9.5 30.5,9.88 31.25,9.88 31.88,10.5 36.38,10.5 38.38,12.5 38.38,15.62 34.5,19.5 34.5,19.75 S2.A2
N$20  (via drill 0.25, 0.25 pad 0.25)
  Top 0.152: v29.75,11 27,8.25 24.25,8.25 23.25,7.25 IC1.42 | v29,23.5 29.5,23.5 v34,28
  Bottom 0.152: v29.75,11 29.62,11.12 29.62,14.25 30.5,15.12 30.5,21.25 30.12,21.62 30.12,22.38 v29,23.5 | S7.1 39.5,34.12 36.5,34.12 35.25,32.88 35.25,29.5 34,28.25 v34,28
N$21  (via drill 0.25, 0.25 pad 0.25)
  Top 0.152: v22.88,3.25 21.88,4.25 21.88,5.25 21.62,5.5 21.62,5.88 22.38,6.62 22.38,7.12 22.75,7.5 IC1.41 | v25.25,18.5 24.5,19.25 24.5,19.75 S3.A2 | v26.38,7 27.5,7 v28.25,7.75
  Bottom 0.152: v22.88,3.25 23.88,3.25 23.88,3.5 25.75,5.38 25.75,6.12 26.38,6.75 v26.38,7 | v25.25,18.5 25.25,15.75 28,13 28,12.12 28.12,12 28.12,10.62 27,9.5 27,9 v28.25,7.75 28.25,8
N$25
  Bottom 0.152: S4.2 1.57,23.43 D2.3
PWR_CTRL  (via drill 0.25, 0.25 pad 0.25)
  Top 0.152: IC1.40 22.5,8 22.88,8.38 22.88,8.88 20.5,11.25 v18.75,11.25 | v9.25,12.25 9.25,11.75 9.5,11.5 12.12,11.5 v12.38,11.62
  Bottom 0.152: Q2.1 8.62,15.38 9,15.38 9.88,14.5 9.88,12.88 v9.25,12.25 | v12.38,11.62 13.12,11.62 14.12,12.62 14.62,12.62 15.12,12.12 15.12,11.38 15.25,11.25 v18.75,11.25
SD_CS  (via drill 0.25)
  Top 0.152: v30.25,14 30,14 29.25,13.25 IC1.19
  Bottom 0.152: v30.25,14 30.62,13.62 30.62,11.5 33.75,8.38 33.75,8 34.38,7.38 JP1.CD/DAT3
SD_DETECT  (via drill 0.25)
  Top 0.152: v27.25,12 28.75,12 29.5,12.75 IC1.18
  Bottom 0.152: v27.25,12 26.62,12.62 24.62,12.62 24.62,13.12 JP1.CD1 | v27.25,12 27.5,12 | JP1.CD2 24.62,7.5 27.75,10.88 27.75,11.5 v27.25,12
SPI1_MISO  (via drill 0.25)
  Top 0.152: v33.5,13 31,13 30.25,12.25 IC1.16
  Bottom 0.152: v33.5,13 34.75,13 JP1.DAT0
SPI1_MOSI  (via drill 0.25)
  Top 0.152: v31.25,13.75 30,12.5 IC1.17
  Bottom 0.152: v31.25,13.75 32.88,12.12 32.88,10.25 34.62,8.5 JP1.CMD
SPI1_SCK  (via drill 0.25)
  Top 0.152: v33.5,11.38 32.25,12.62 31.38,12.62 30.62,11.88 IC1.15
  Bottom 0.152: v33.5,11.38 34.12,10.75 34.75,10.75 JP1.CLK
SWCLK  (via drill 0.25)
  Top 0.152: v16,5.62 18,7.62 20.12,7.62 21.38,8.88 IC1.37 | v27.88,2.88 28.75,2.88 28.88,3 J1.P$2
  Bottom 0.152: v16,5.62 17.38,4.25 17.38,2.88 18.75,1.5 27.25,1.5 27.25,2.25 v27.88,2.88
SWDIO  (via drill 0.25, 0.25 pad 0.25)
  Top 0.152: v23,11.12 22.75,11.12 22.12,11.75 IC1.34 | v30,3.75 30.75,3 J1.P$1 | v24.5,21 28,21 28.5,20.5 28.5,19.5 28.88,19.12 v29.38,19.12
  Bottom 0.152: v23,11.12 21.62,12.5 21.62,15.25 21.38,15.5 21.38,16 23.75,18.38 23.75,20.25 v24.5,21 | v30,3.75 30,8.25 29.12,9.12 29.12,11.25 29.25,11.38 29.25,15.75 29.38,15.88 v29.38,19.12
UART2_RX  (via drill 0.25)
  Top 0.152: v2.88,11.88 1.88,11.88 U1.41 | v15.38,2 16.12,1.25 27.12,1.25 v27.88,2 | v29.88,10.12 30.25,10.12 31.25,11.12 IC1.13
  Bottom 0.152: v2.88,11.88 3,11.75 3,8.62 7.88,3.75 9.75,3.75 10,3.5 10.75,3.5 12.75,1.5 13.25,2 v15.38,2 | v27.88,2 29,3.12 30.62,3.12 30.62,9.38 v29.88,10.12
UART2_TX  (via drill 0.25)
  Top 0.152: v8.75,10.25 7.88,11.12 1.88,11.12 U1.42 | v31.88,9.38 31.38,8.88 IC1.12
  Bottom 0.152: v8.75,10.25 10.5,8.5 10.5,5.25 10.75,5.25 11.5,4.5 15,4.5 16,3.5 16.38,3.5 16.38,1.88 16.75,1.5 18.25,1.5 18.62,1.12 31.38,1.12 31.38,8.88 v31.88,9.38
USART1_RX
  Top 0.152: IC1.31 23.12,12.88 22.25,13.75 22.25,15.12 23.38,16.25 23.38,18.88 23.12,19.12 23.12,22.12 23.5,22.5 29,22.5 30,21.5 30,20.5 35.38,15.12 36.5,15.12 J3.P$2
USART1_TX
  Top 0.152: IC1.30 23.5,13.25 22.62,14.12 22.62,14.75 26.38,18.5 30.38,18.5 35.88,13 36.5,13 J3.P$1
V+  (via drill 0.25, 0.25 pad 0.25, 0.25 pad 1.02)
  Top 0.254: v9.12,16.75 4.42,16.75
  Top 0.406: v7,27.5 8,28.5 9.5,28.5 10,29 v10,32.5 | v7.25,40.5 7.19,40.44 D1.1 | v4.62,14.25 4.42,14.46 4.42,16.75 U1.32 | v7.75,20.62 9.5,20.62 v10.88,19.25 | v17,33.5 20.02,33.5 R5.1
  Bottom 0.152: Q1.3 7.53,20.62 v7.75,20.62 | v10.88,19.25 11,19.12 R13.2
  Bottom 0.254: v9.12,16.75 9.62,17.25 9.62,18.12 10.75,19.25 v10.88,19.25 R13.2
  Bottom 0.406: Q1.3 7,21.1 v7,27.5 | v7.25,40.5 7.5,40.5 8,40 8,34.5 v10,32.5 11.5,32.5 12,33 16.5,33 v17,33.5 | R6.1 4.62,12.41 v4.62,14.25
V_BATT
  Bottom 0.254: BT1.3 6,29.2 6,21 4.45,19.45 | 4.45,19.45 R12.2 | 4.45,19.45 5.5,18.4 Q1.2
VREGEN  (via drill 0.25, 0.25 pad 0.25)
  Top 0.152: v9.5,19.75 9.12,19.38 8.62,19.38 7.62,18.38 7.62,17.88 U1.28 | v21,13.38 21.38,13.38 22.5,12.25 IC1.33 | v10.5,20.75 13.25,20.75 14,21.5 v15.88,21.5
  Bottom 0.152: v10.5,20.75 v9.5,19.75 | v15.88,21.5 16,21.5 17,20.5 17,15 17.5,14.5 20.5,14.5 21,14 v21,13.38
VSENSE  (via drill 0.25 pad 0.25)
  Top 0.152: IC1.32 22.75,12.5 21.5,13.75 21.5,14.62 20.56,15.56 20.38,15.75 20.12,16 v15.5,16
  Bottom 0.152: R13.1 11,15.12 | 11,15.12 14.62,15.12 v15.5,16 | 11,15.12 R14.2

### Text on the board
tNames: Cefali | BT Player | V1.0